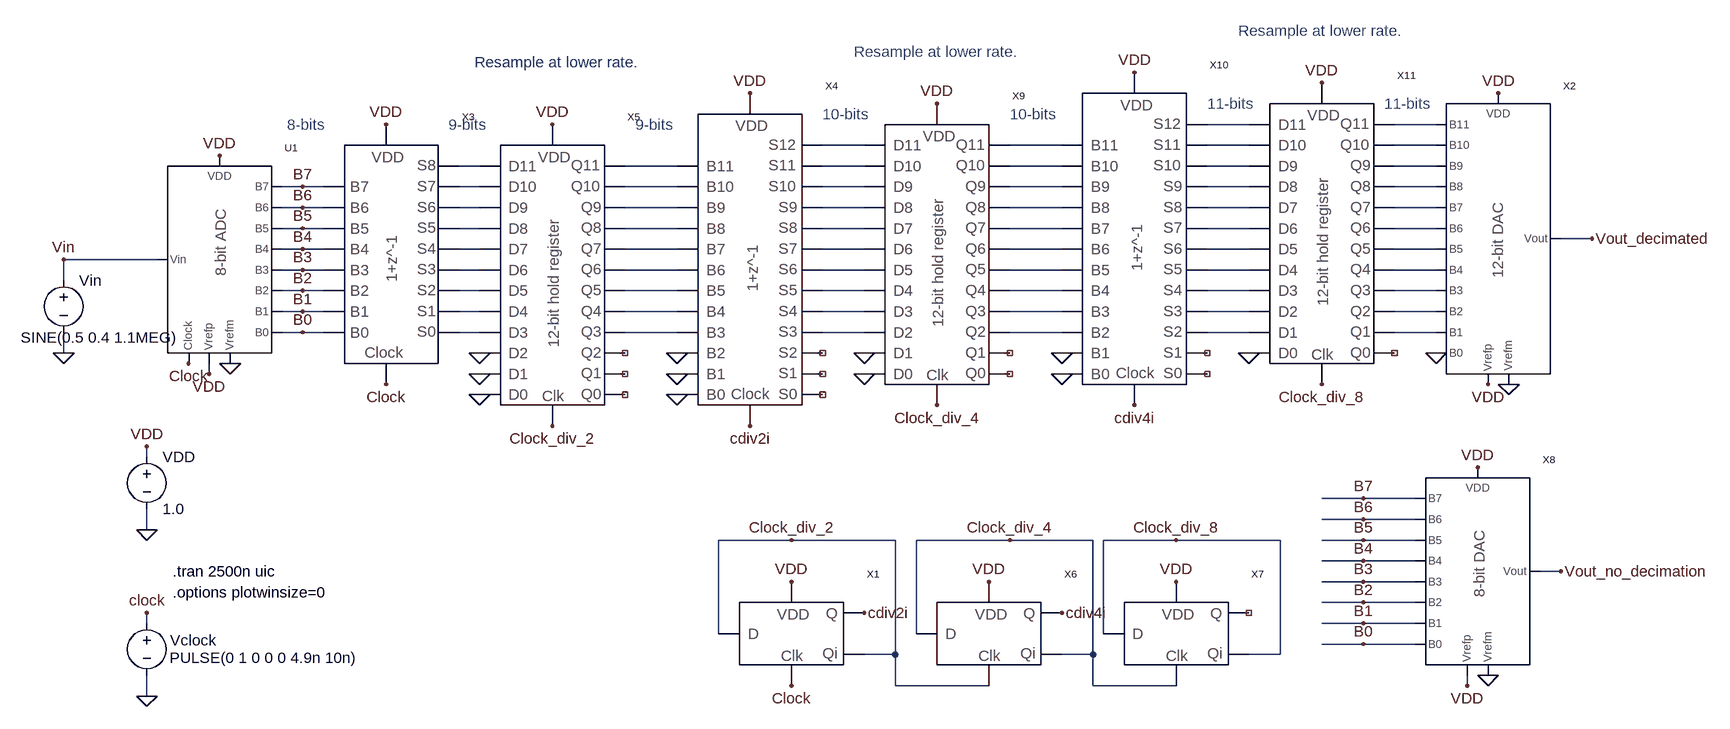
[diagram p0: schematic _Fig4_34_L=1_MSD.asc]
_Fig4_34_L=1_MSD.asc, the LTspice schematic file:
Version 4
SHEET 1 3412 1116
WIRE 2432 -720 2368 -720
WIRE 2720 -720 2656 -720
WIRE 1840 -688 1776 -688
WIRE 2144 -688 2064 -688
WIRE 2432 -688 2368 -688
WIRE 2720 -688 2656 -688
WIRE 1248 -656 1216 -656
WIRE 1552 -656 1472 -656
WIRE 1840 -656 1776 -656
WIRE 2144 -656 2064 -656
WIRE 2432 -656 2368 -656
WIRE 2720 -656 2656 -656
WIRE 976 -624 944 -624
WIRE 1008 -624 976 -624
WIRE 1248 -624 1216 -624
WIRE 1552 -624 1472 -624
WIRE 1840 -624 1776 -624
WIRE 2144 -624 2064 -624
WIRE 2432 -624 2368 -624
WIRE 2720 -624 2656 -624
WIRE 976 -592 944 -592
WIRE 1008 -592 976 -592
WIRE 1248 -592 1216 -592
WIRE 1552 -592 1472 -592
WIRE 1840 -592 1776 -592
WIRE 2144 -592 2064 -592
WIRE 2432 -592 2368 -592
WIRE 2720 -592 2656 -592
WIRE 976 -560 944 -560
WIRE 1008 -560 976 -560
WIRE 1248 -560 1216 -560
WIRE 1552 -560 1472 -560
WIRE 1840 -560 1776 -560
WIRE 2144 -560 2064 -560
WIRE 2432 -560 2368 -560
WIRE 2720 -560 2656 -560
WIRE 2960 -544 2912 -544
WIRE 976 -528 944 -528
WIRE 1008 -528 976 -528
WIRE 1248 -528 1216 -528
WIRE 1552 -528 1472 -528
WIRE 1840 -528 1776 -528
WIRE 2144 -528 2064 -528
WIRE 2432 -528 2368 -528
WIRE 2720 -528 2656 -528
WIRE 752 -512 608 -512
WIRE 976 -496 944 -496
WIRE 1008 -496 976 -496
WIRE 1248 -496 1216 -496
WIRE 1552 -496 1472 -496
WIRE 1840 -496 1776 -496
WIRE 2144 -496 2064 -496
WIRE 2432 -496 2368 -496
WIRE 2720 -496 2656 -496
WIRE 608 -480 608 -512
WIRE 976 -464 944 -464
WIRE 1008 -464 976 -464
WIRE 1248 -464 1216 -464
WIRE 1552 -464 1472 -464
WIRE 1840 -464 1776 -464
WIRE 2144 -464 2064 -464
WIRE 2432 -464 2368 -464
WIRE 2720 -464 2656 -464
WIRE 976 -432 944 -432
WIRE 1008 -432 976 -432
WIRE 1248 -432 1216 -432
WIRE 1552 -432 1472 -432
WIRE 1840 -432 1776 -432
WIRE 2144 -432 2064 -432
WIRE 2432 -432 2368 -432
WIRE 2720 -432 2656 -432
WIRE 976 -400 944 -400
WIRE 1008 -400 976 -400
WIRE 1248 -400 1216 -400
WIRE 1552 -400 1472 -400
WIRE 1840 -400 1776 -400
WIRE 2144 -400 2064 -400
WIRE 2432 -400 2368 -400
WIRE 2720 -400 2656 -400
WIRE 608 -368 608 -400
WIRE 832 -336 832 -352
WIRE 736 -208 736 -224
WIRE 2608 -144 2544 -144
WIRE 2688 -144 2608 -144
WIRE 2608 -112 2544 -112
WIRE 2688 -112 2608 -112
WIRE 736 -96 736 -128
WIRE 1728 -80 1616 -80
WIRE 1888 -80 1728 -80
WIRE 2064 -80 1920 -80
WIRE 2192 -80 2064 -80
WIRE 2320 -80 2208 -80
WIRE 2480 -80 2320 -80
WIRE 2608 -80 2544 -80
WIRE 2688 -80 2608 -80
WIRE 2608 -48 2544 -48
WIRE 2688 -48 2608 -48
WIRE 2912 -32 2880 -32
WIRE 2608 -16 2544 -16
WIRE 2688 -16 2608 -16
WIRE 2608 16 2544 16
WIRE 2688 16 2608 16
WIRE 736 48 736 32
WIRE 2608 48 2544 48
WIRE 2688 48 2608 48
WIRE 1616 64 1616 -80
WIRE 1920 64 1920 -80
WIRE 2208 64 2208 -80
WIRE 2608 80 2544 80
WIRE 2688 80 2608 80
WIRE 1888 96 1888 -80
WIRE 1888 96 1840 96
WIRE 2192 96 2192 -80
WIRE 2192 96 2144 96
WIRE 2480 96 2480 -80
WIRE 2480 96 2432 96
WIRE 1888 144 1888 96
WIRE 2032 144 1888 144
WIRE 2192 144 2192 96
WIRE 2320 144 2192 144
WIRE 2768 144 2768 128
WIRE 736 160 736 128
FLAG 608 -368 0
FLAG 608 -512 Vin
FLAG 736 160 0
FLAG 736 32 clock
FLAG 736 -96 0
FLAG 736 -224 VDD
FLAG 2960 -544 Vout_decimated
FLAG 2816 -768 VDD
FLAG 2832 -320 0
FLAG 976 -624 B7
FLAG 976 -592 B6
FLAG 976 -560 B5
FLAG 976 -528 B4
FLAG 976 -496 B3
FLAG 976 -464 B2
FLAG 976 -432 B1
FLAG 976 -400 B0
FLAG 848 -672 VDD
FLAG 864 -352 0
FLAG 832 -336 VDD
FLAG 2800 -320 VDD
FLAG 1104 -720 VDD
FLAG 1104 -320 Clock
FLAG 1728 -16 VDD
FLAG 1728 144 Clock
FLAG 2032 -16 VDD
FLAG 2320 -16 VDD
FLAG 2320 -80 Clock_div_8
FLAG 2608 -144 B7
FLAG 2608 -112 B6
FLAG 2608 -80 B5
FLAG 2608 -48 B4
FLAG 2608 -16 B3
FLAG 2608 16 B2
FLAG 2608 48 B1
FLAG 2608 80 B0
FLAG 2800 128 0
FLAG 2768 144 VDD
FLAG 2912 -32 Vout_no_decimation
FLAG 800 -352 Clock
FLAG 2720 -368 0
FLAG 2064 -80 Clock_div_4
FLAG 1728 -80 Clock_div_2
FLAG 1552 -368 0
FLAG 1552 -336 0
FLAG 1552 -304 0
FLAG 1664 -768 VDD
FLAG 1360 -720 VDD
FLAG 1248 -304 0
FLAG 1248 -336 0
FLAG 1248 -368 0
FLAG 1952 -752 VDD
FLAG 2144 -368 0
FLAG 2144 -336 0
FLAG 2256 -800 VDD
FLAG 2544 -784 VDD
FLAG 2784 -192 VDD
FLAG 2432 -368 0
FLAG 1840 -368 0
FLAG 1840 -336 0
FLAG 1360 -256 Clock_div_2
FLAG 1952 -288 Clock_div_4
FLAG 2544 -320 Clock_div_8
FLAG 1840 32 cdiv2i
FLAG 1664 -256 cdiv2i
FLAG 2256 -288 cdiv4i
FLAG 2144 32 cdiv4i
SYMBOL voltage 608 -496 R0
WINDOW 123 0 0 Left 0
WINDOW 39 0 0 Left 0
WINDOW 3 -66 104 Left 0
SYMATTR Value SINE(0.5 0.4 1.1MEG)
SYMATTR InstName Vin
SYMBOL voltage 736 32 R0
WINDOW 0 36 42 Left 0
WINDOW 3 35 69 Left 0
WINDOW 123 0 0 Left 0
WINDOW 39 0 0 Left 0
SYMATTR InstName Vclock
SYMATTR Value PULSE(0 1 0 0 0 4.9n 10n)
SYMBOL voltage 736 -224 R0
WINDOW 123 0 0 Left 0
WINDOW 39 0 0 Left 0
SYMATTR InstName VDD
SYMATTR Value 1.0
SYMBOL Ideal_8_bit_ADC 768 -368 R0
SYMATTR InstName U1
SYMBOL Ideal_12_bit_DAC 2736 -336 R0
SYMATTR InstName X2
SYMBOL DFF 1648 112 R0
SYMATTR InstName X1
SYMBOL DFF 1952 112 R0
SYMATTR InstName X6
SYMBOL DFF 2240 112 R0
SYMATTR InstName X7
SYMBOL Ideal_8_bit_DAC 2704 112 R0
SYMATTR InstName X8
SYMBOL 12_bit_register 1280 -288 R0
SYMATTR InstName X5
SYMBOL 8_bit_averager 1040 -352 R0
SYMATTR InstName X3
SYMBOL 12_bit_averager 1584 -288 R0
SYMATTR InstName X4
SYMBOL 12_bit_register 1872 -320 R0
SYMATTR InstName X9
SYMBOL 12_bit_averager 2176 -320 R0
SYMATTR InstName X10
SYMBOL 12_bit_register 2464 -352 R0
SYMATTR InstName X11
TEXT 776 -32 Left 0 !.tran 2500n uic
TEXT 776 0 Left 0 !.options plotwinsize=0
TEXT 1240 -816 Left 0 ;Resample at lower rate.
TEXT 1240 -816 Left 0 ;Resample at lower rate.
TEXT 1824 -832 Left 0 ;Resample at lower rate.
TEXT 2416 -864 Left 0 ;Resample at lower rate.
TEXT 952 -720 Left 0 ;8-bits
TEXT 1200 -720 Left 0 ;9-bits
TEXT 1488 -720 Left 0 ;9-bits
TEXT 1776 -736 Left 0 ;10-bits
TEXT 2064 -736 Left 0 ;10-bits
TEXT 2368 -752 Left 0 ;11-bits
TEXT 2640 -752 Left 0 ;11-bits

The netlist it stands for:
* _Fig4_34_L=1_MSD.asc
Vin Vin 0 SINE(0.5 0.4 1.1MEG)
Vclock clock 0 PULSE(0 1 0 0 0 4.9n 10n)
VDD VDD 0 1.0
XU1 B7 B6 B5 B4 B3 B2 B1 B0 Vin VDD 0 clock VDD Ideal_8_bit_ADC  ; pins B7 B6 B5 B4 B3 B2 B1 B0 Vin Vrefp Vrefm Clock VDD
XX2 N002 N006 N012 N018 N024 N030 N036 N042 N048 N054 N060 0 Vout_decimated VDD 0 VDD Ideal_12_bit_DAC  ; pins B11 B10 B9 B8 B7 B6 B5 B4 B3 B2 B1 B0 Vout Vrefp Vrefm VDD
XX1 Clock_div_2 clock cdiv2i Clock_div_2 VDD DFF  ; pins D Clk Q Qi VDD
XX6 Clock_div_4 Clock_div_2 cdiv4i Clock_div_4 VDD DFF  ; pins D Clk Q Qi VDD
XX7 Clock_div_8 Clock_div_4 NC_01 Clock_div_8 VDD DFF  ; pins D Clk Q Qi VDD
XX8 B7 B6 B5 B4 B3 B2 B1 B0 Vout_no_decimation VDD 0 VDD Ideal_8_bit_DAC  ; pins B7 B6 B5 B4 B3 B2 B1 B0 Vout Vrefp Vrefm VDD
XX5 0 0 0 N055 N049 N043 N037 N031 N025 N019 N013 N007 NC_02 NC_03 NC_04 N056 N050 N044 N038 N032 N026 N020 N014 N008 Clock_div_2 VDD 12_bit_register  ; pins D0 D1 D2 D3 D4 D5 D6 D7 D8 D9 D10 D11 Q0 Q1 Q2 Q3 Q4 Q5 Q6 Q7 Q8 Q9 Q10 Q11 Clk VDD
XX3 B0 B1 B2 B3 B4 B5 B6 B7 N055 N049 N043 N037 N031 N025 N019 N013 N007 clock VDD 8_bit_averager  ; pins B0 B1 B2 B3 B4 B5 B6 B7 S0 S1 S2 S3 S4 S5 S6 S7 S8 Clock VDD
XX4 0 0 0 N056 N050 N044 N038 N032 N026 N020 N014 N008 NC_05 NC_06 NC_07 N057 N051 N045 N039 N033 N027 N021 N015 N009 N003 cdiv2i VDD 12_bit_averager  ; pins B0 B1 B2 B3 B4 B5 B6 B7 B8 B9 B10 B11 S0 S1 S2 S3 S4 S5 S6 S7 S8 S9 S10 S11 S12 Clock VDD
XX9 0 0 N057 N051 N045 N039 N033 N027 N021 N015 N009 N003 NC_08 NC_09 N058 N052 N046 N040 N034 N028 N022 N016 N010 N004 Clock_div_4 VDD 12_bit_register  ; pins D0 D1 D2 D3 D4 D5 D6 D7 D8 D9 D10 D11 Q0 Q1 Q2 Q3 Q4 Q5 Q6 Q7 Q8 Q9 Q10 Q11 Clk VDD
XX10 0 0 N058 N052 N046 N040 N034 N028 N022 N016 N010 N004 NC_10 NC_11 N059 N053 N047 N041 N035 N029 N023 N017 N011 N005 N001 cdiv4i VDD 12_bit_averager  ; pins B0 B1 B2 B3 B4 B5 B6 B7 B8 B9 B10 B11 S0 S1 S2 S3 S4 S5 S6 S7 S8 S9 S10 S11 S12 Clock VDD
XX11 0 N059 N053 N047 N041 N035 N029 N023 N017 N011 N005 N001 NC_12 N060 N054 N048 N042 N036 N030 N024 N018 N012 N006 N002 Clock_div_8 VDD 12_bit_register  ; pins D0 D1 D2 D3 D4 D5 D6 D7 D8 D9 D10 D11 Q0 Q1 Q2 Q3 Q4 Q5 Q6 Q7 Q8 Q9 Q10 Q11 Clk VDD
.tran 2500n uic
.options plotwinsize=0
* Resample at lower rate.
* Resample at lower rate.
* Resample at lower rate.
* Resample at lower rate.
* 8-bits
* 9-bits
* 9-bits
* 10-bits
* 10-bits
* 11-bits
* 11-bits
.backanno
.end